# EAGLE design BigLMA_2 (EAGLE 5.11)
BOM: INCLUDE; DATABASE: ./../../../../eagle/PARTSDB.TXT; PARTNO: AI-3035-TWT-3V-R
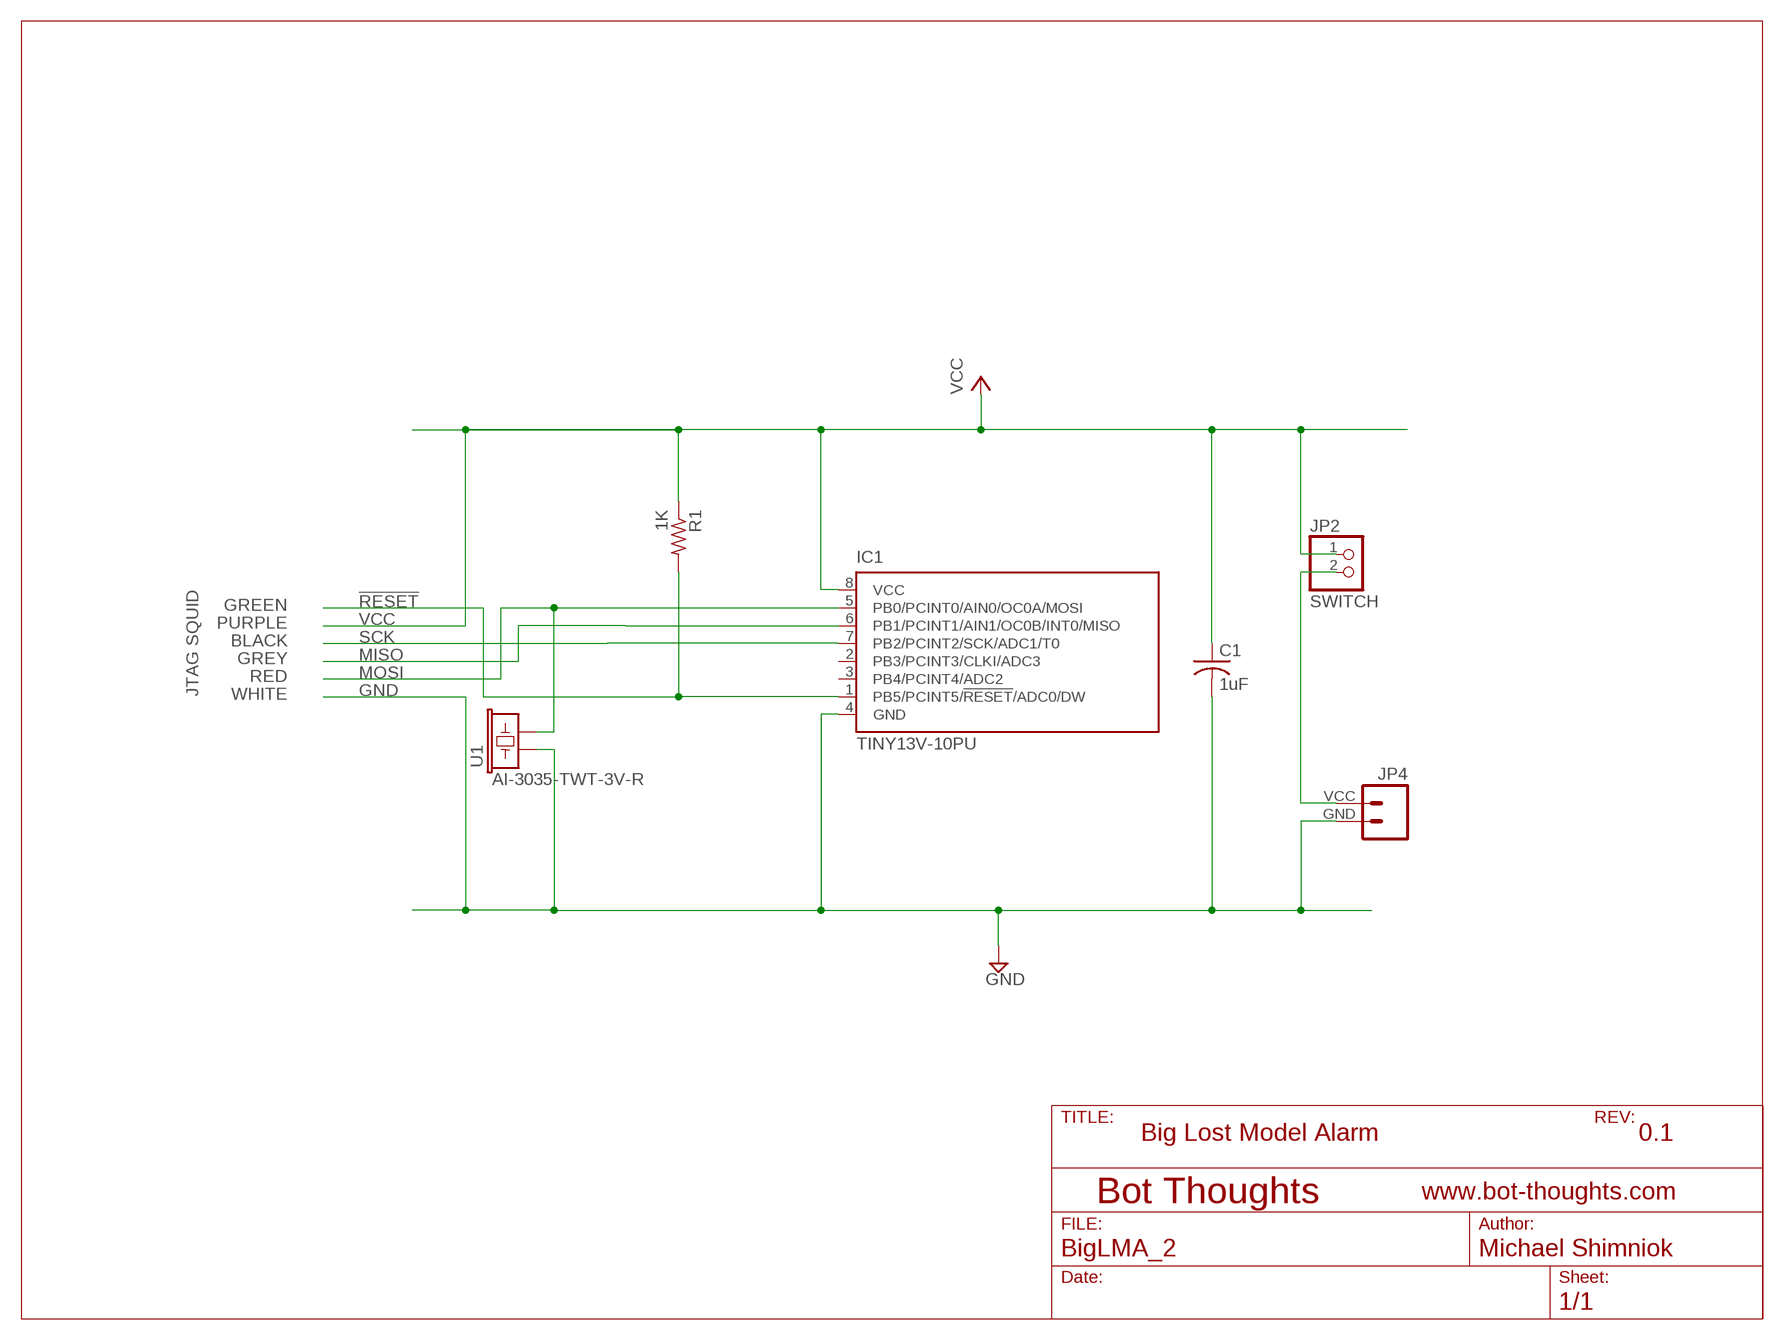
[diagram p0: schematic, sheet 1]

## Parts
C1  1uF  C-USC0603K  [C0603K]
IC1  TINY13V-10PU  [DIL08]
JP2  SWITCH  PINHD-1X02_2.54-S  [1X02-S]
JP4  M024UCON-15767  [JST-2-SMD-VERT]
R1  1K  R-US_R0603  [R0603]
U1  AI-3035-TWT-3V-R  AI-3035-TWT-3V-RVPTH  [BUZZER-30MM_V_PTH]

## Nets
!RESET: IC1.1(PB5/PCINT5/!RESET!/ADC0/DW) R1.2
GND: C1.2 IC1.4(GND) JP4.GND U1.P$2
MISO: IC1.6(PB1/PCINT1/AIN1/OC0B/INT0/MISO)
MOSI: IC1.5(PB0/PCINT0/AIN0/OC0A/MOSI) U1.P$3
N$2: JP2.2 JP4.VCC
SCK: IC1.7(PB2/PCINT2/SCK/ADC1/T0)
VCC: C1.1 IC1.8(VCC) JP2.1 R1.1
Unconnected: IC1.2(PB3/PCINT3/CLKI/ADC3) IC1.3(PB4/PCINT4/ADC2)

## Notes on the sheet
- GREEN
- PURPLE
- BLACK
- GREY
- RED
- WHITE
- JTAG SQUID
- Big Lost Model Alarm | 0.1

## Library data of the parts
C1 = rcl:C-US: CAPACITOR, American symbol
IC1 = atmel:TINY13: 8-bit AVR Microcontroller with 1K Bytes In-System Programmable Flash Source: http://www.atmel.com/dyn/resources/prod_documents/2535S.pdf; MPN: ATTINY13V-10PU; OC_FARNELL: 9171576; OC_NEWARK: 96K6523
JP2 = pinhead-2:PINHD-1X02: PIN HEADER
JP4 = SparkFun:M02: Header 2 Standard 2-pin 0.1" header. Use with straight break away headers (SKU : PRT-00116), right angle break away headers (PRT-00553), swiss pins (PRT-00743), machine pins (PRT-00117), and female headers (PRT-00115). Molex polarized connector foot print use with SKU : PRT-08233 with associated crimp pins and housings.
R1 = rcl:R-US_: RESISTOR, American symbol
U1 = mes_buzzers:AI-3035-TWT-3V-R: PUI Audio AI-3035-TWT-3V-R 30mm piezo buzzer, 100dBA, 9mA

## Board
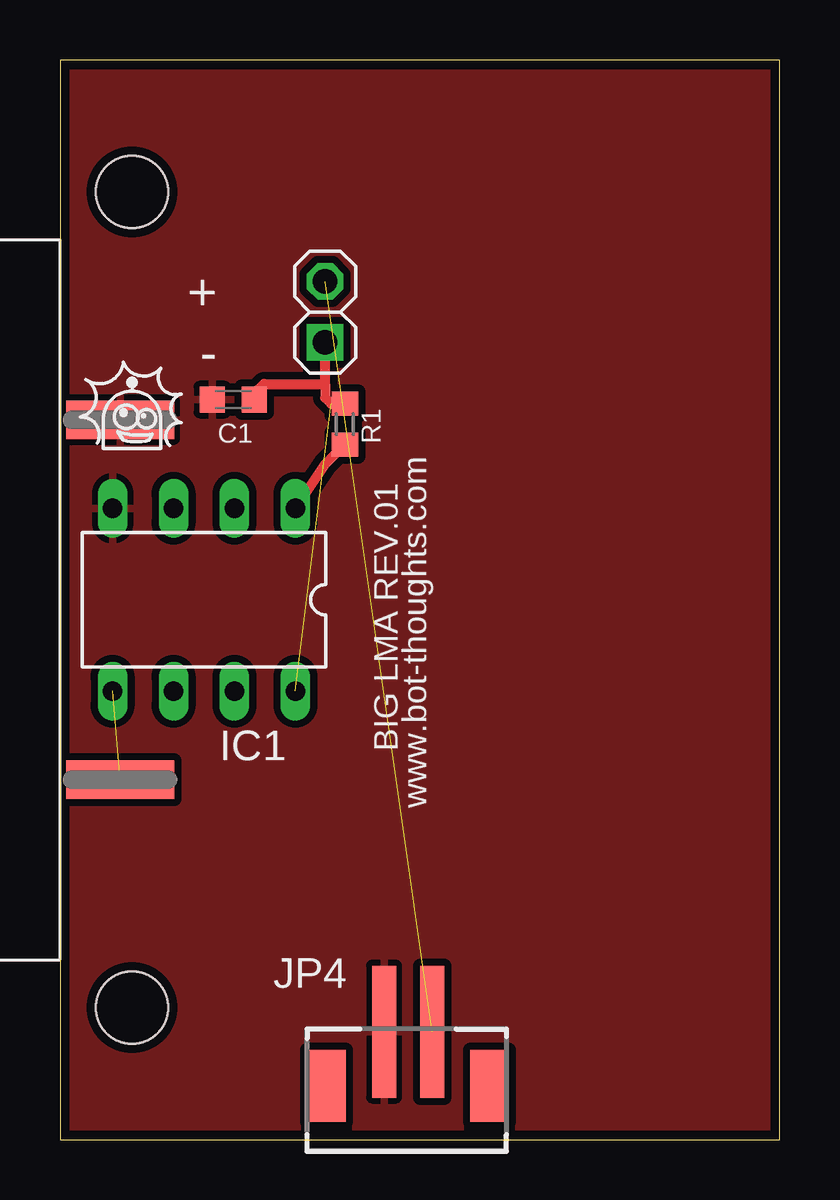
[diagram p1: board, top side]

Size 30 x 45 mm. Coordinates in mm from the lower left corner, seen from the top.
Outline: 0,0 30,0 30,45 0,45 0,0
Copper layers (1*16): Top 0.0356mm / dielectric 1.5011mm / Bottom 0.0356mm
Design rules "LaenPCBOrder": minimum track width 6mil, minimum drill 13mil, track to track 6mil, track to pad 6mil, pad to pad 6mil, via to via 6mil, smd to smd 6mil, copper to edge 15mil, drill to drill 6mil, minimum pad ring 7mil, minimum via ring 7mil, stop-mask expansion 4mil, vias tented up to drill 0mil, thermal gap 10mil
Holes 3 mm at 3,39.5 3,5.5

### Footprints (pad centres in the part's own frame; a part is rotated, then mirrored left to right if it is on the bottom)
C0603K = smd 1.05 x 1.08: 1 -0.875,0; 2 0.875,0
DIL08 = drill 0.813 long: 1 -3.81,-3.81; 2 -1.27,-3.81; 3 1.27,-3.81; 4 3.81,-3.81; 5 3.81,3.81; 6 1.27,3.81; 7 -1.27,3.81; 8 -3.81,3.81
1X02-S = drill 1.016 square: 1 -1.27,0 | drill 1.016 octagon: 2 1.27,0
JST-2-SMD-VERT = smd 1 x 5.5: GND 1,-2; VCC -1,-2 | smd 1.6 x 3: P$1 -3.4,0.27; P$2 3.4,0.27
R0603 = smd 1 x 1.1: 1 -0.85,0; 2 0.85,0
BUZZER-30MM_V_PTH = smd 4.5 x 1.6: P$2 0,-7.5; P$3 0,7.5

### Placement (x,y rotation side)
C1  7.22,30.84 180 top
IC1  6,22.5 180 top
JP2  11.04,34.49 90 top
JP4  14.5,2.5 180 top
R1  11.87,29.82 270 top
U1  2.5,22.5 180 top

### Tracks (layer width: path | path; a pad name or v marks a point on that pad's centre or on a via)
!RESET
  Top 0.406: IC1.1 11.04,28.15 R1.2
GND
  pour Top (isolate 0.305): 0,44.92 30.19,44.92 30.19,-0.06 0,-0.06
MOSI  (1 unrouted)
N$2  (1 unrouted)
VCC  (1 unrouted)
  Top 0.406: 11.04,31.49 JP2.1 | R1.1 11.29,30.67 11.04,30.92 11.04,31.49 | C1.1 8.09,31.09 8.5,31.5 11.04,31.5 11.04,31.49

### Text on the board
tNames: + | - | BIG LMA REV.01 | www.bot-thoughts.com
_tsilk: R1 | R4 | R3 | C1 | IC1
_bsilk: CR1225 | SW | SWITCH